# Altium schematic sheet Motor PCB.SchDoc
size Letter
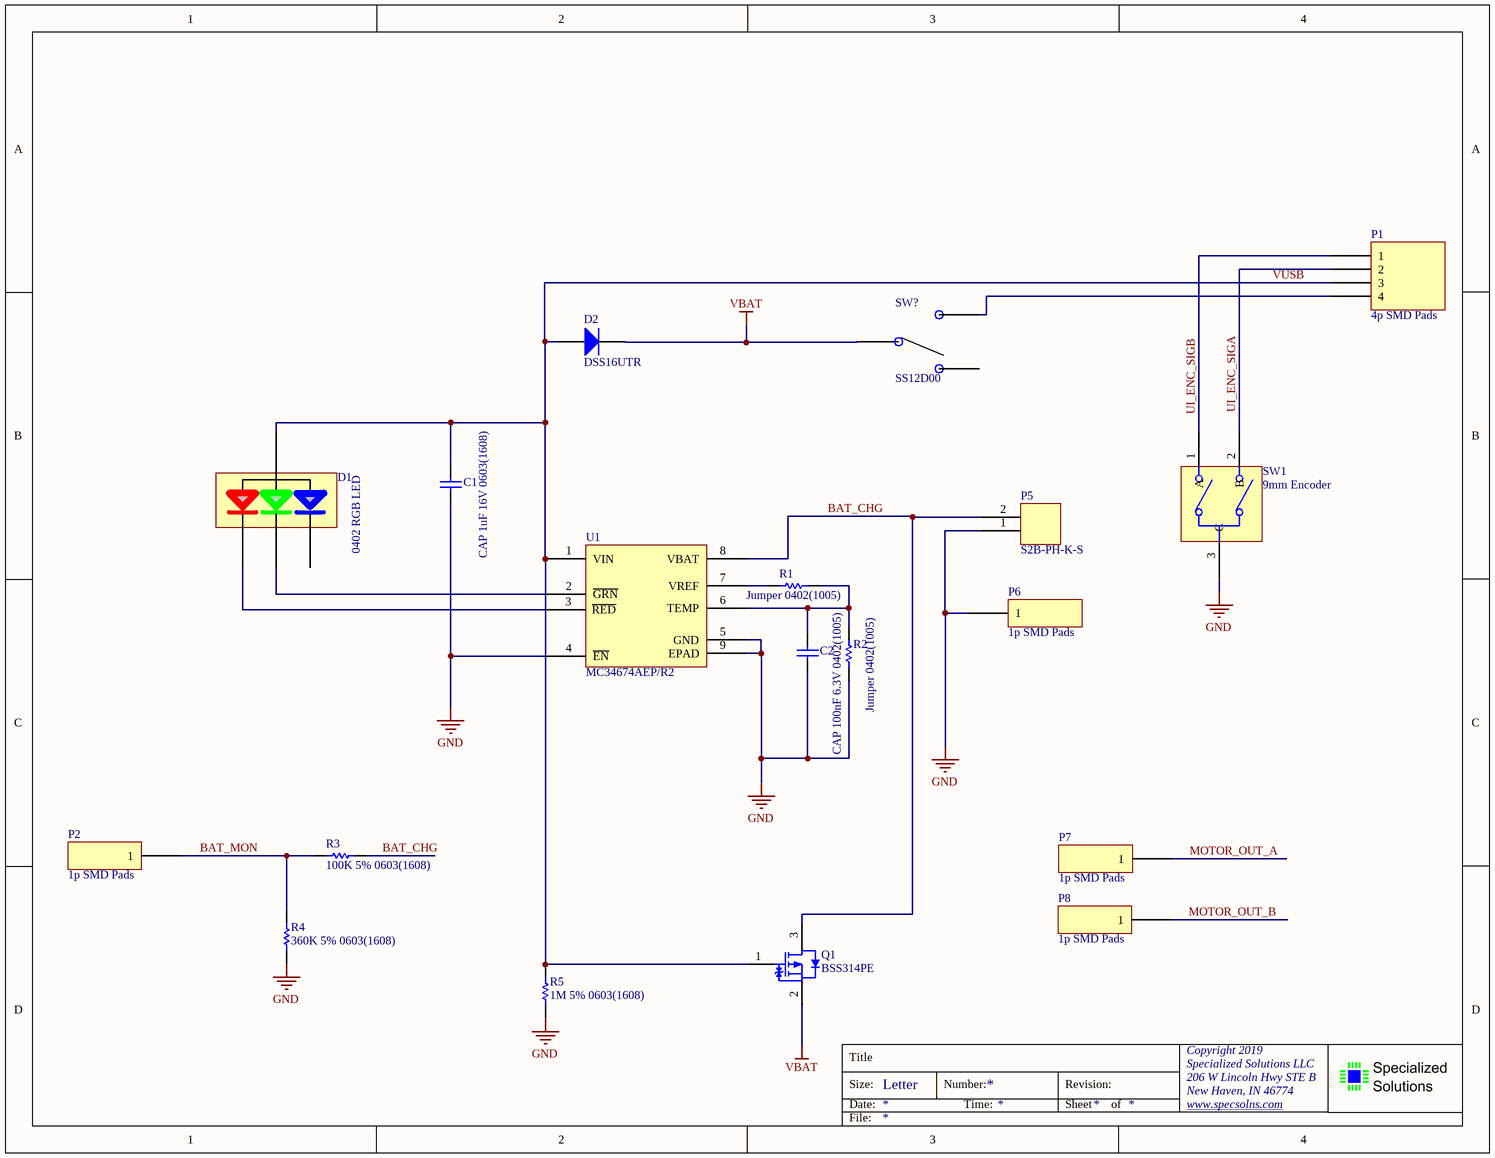
[diagram p0: Motor PCB.SchDoc]

## Parts
C1  CAP 1uF 16V 0603(1608)  [CAPC0603(1608)100_N]
C2  CAP 100nF 6.3V 0402(1005)  [CAPC0402(1005)60_N]
D1  0402 RGB LED  [0404 RGB LED]
D2  DSS16UTR  [MCC-SOD-123FL_V]
P1  4p SMD Pads  [4p SMD pad]
P2  1p SMD Pads  [1p SMD pad]
P5  S2B-PH-K-S  [S2B-PH-K-S]
P6  1p SMD Pads  [1p SMD pad]
P7  1p SMD Pads  [1p SMD pad]
P8  1p SMD Pads  [1p SMD pad]
Q1  BSS314PE  [INF-PG-SOT23_N]
R1  Jumper 0402(1005)  [RESC0402(1005)_N]
R2  Jumper 0402(1005)  [RESC0402(1005)_N]
R3  100K 5% 0603(1608)  [RESC0603(1608)_N]
R4  360K 5% 0603(1608)  [RESC0603(1608)_L]
R5  1M 5% 0603(1608)  [RESC0603(1608)_N]
SW1  9mm Encoder  [9mm encoder]
SW?  SS12D00  [DC2019 Switch]
U1  MC34674AEP/R2  [SON50P300X65_HS-9N]

## Nets
GND: C1.1 C2.1 P5.1 P6.1 R2.1 R4.1 R5.1 SW1.3(C) U1.4(~{EN}) U1.5(GND) U1.9(EPAD)
VBAT: D2.2(K) Q1.2(SOURCE) SW?.2
BAT_CHG: P5.2 Q1.3(DRAIN) R3.1 U1.8(VBAT)
BAT_MON: P2.1 R3.2 R4.2
MOTOR_OUT_A: P7.1
MOTOR_OUT_B: P8.1
UI_ENC_SIGA: P1.2 SW1.2(B)
UI_ENC_SIGB: P1.1 SW1.1(A)
VUSB: C1.2 D1.1 D2.1(A) P1.3 Q1.1(GATE) R5.2 U1.1(VIN)
NetC2_2: C2.2 R1.2 R2.2 U1.6(TEMP)
NetD1_2: D1.2 U1.3(~{RED})
NetD1_3: D1.3 U1.2(~{GRN})
NetP1_4: P1.4 SW?.3
NetR1_1: R1.1 U1.7(VREF)

Not connected (* = marked no-connect by the designer): D1 4; SW? 1

## Notes on the sheet
- Title
- Size:
- Date:
- Letter
- Number:
- Time:
- Revision:
- Sheet
- of
- Copyright 2019
- Specialized Solutions LLC
- 206 W Lincoln Hwy STE B
- New Haven, IN 46774
- www.specsolns.com <http://www.specsolns.com>
- File:

## Library data of the parts
C1 = CMP-1035-02736-1: CAP 1uF 16V ±5% 0603 (1608 Metric) Thickness 1mm SMD; Case-Metric: 1608; Case-EIA: 0603; Tolerance: Â±5%; Technology: SMT; Max Thickness: 1 mm; Rated Voltage: 16 V; Value: 1uF
C2 = CMP-1034-02061-1: CAP 100nF 6.3V ±10% 0402 (1005 Metric) Thickness 0.6mm SMD; Tolerance: Â±10%; Case-Metric: 1005; Case-EIA: 0402; Max Thickness: 0.6 mm; Value: 100nF; Technology: SMT; Rated Voltage: 6.3 V
D2 = CMP-2000-07084-1: SCHOTTKY 60V SOD-123FL; Manufacturer: Micro Commercial Components; Diode Configuration: Single; Diode Type: StandardRecovery; Forward Surge Current Ifsm Max: 30A; Forward Current If(AV): 1A; Forward Voltage VF Max: 1.1V; Repetitive Reverse Voltage Vrrm Max: 1kV; Manufacturer URL: http://www.mccsemi.com/; Datasheet URL: http://www.mccsemi.com/up_pdf/SM4001PL-SM4007PL(SOD-123FL).PDF; Package Description: 2-Pin Small Outline Diode, Flat Lead, Body 2.825 x 1.65 mm; Datasheet Version: Rev. H, 05/2015; Package Reference: SOD-123FL; Mounting Technology: SurfaceMount
P1 = 4p SMD
P2 P6-P8 = 1p SMD
P5 = S2B-PH-K-S: JST Right-Angle 2 ckt
Q1 = CMP-1099-00027-1: P-Channel OptiMOS P3 Small-Signal-Transistor, -30 V VDS, -1.5 A ID, -55 to 150 degC, PG-SOT23, Reel, Green; Manufacturer: Infineon; Rth: 250Â K/W; RDS (on) (max): 140Â mOhm; QG: -2.9Â nC; IDpuls (max): -6.1Â A; RDS (on) (max) (@4.5V): 230Â mOhm; Pto t (max): 0.5Â W; Green: TRUE; VDS (max): -30Â V; VGS(th) (max): -2Â V; VGS(th) (min): -1Â V; ID (max): -1.5Â A; ComponentLink2URL: http://www.infineon.com/dgdl/BSS314PE_rev2.3.pdf?folderId=db3a304314dca38901154a72e3951a65&fileId=db3a304330f68606013109b696aa0084; ComponentLink3Description: Package Specification; ComponentLink1URL: http://www.infineon.com/; ComponentLink1Description: Manufacturer URL; Mounting Technology: Surface Mount; PartNumber: BSS314PE; PackageReference: PG-SOT23; PackageVersion: Apr-08; Halogen-free: TRUE; ComponentLink3URL: http://www.infineon.com/dgdl/SOT23-Package_Overview.pdf?folderId=db3a30431936bc4b0119532290053c66&fileId=db3a30431936bc4b0119533468123c85; PackageDescription: 3-Pin Small Outline Transistor Package, 2.9 x 1.3 mm Body, 0.95 mm Pitch; ComponentLink2Description: Datasheet; DatasheetVersion: Rev. 2.3; Packing: Reel
R1 R2 = CMP-1011-00001-1: Jumper 0402 (1005 Metric); Tolerance: None; Case-Metric: 1005; Case-EIA: 0402; Value: 0.00 Ohm; Power: None; Technology: SMT
R3 = CMP-1012-00122-1: 100K 0.1W 5% 0603 (1608 Metric)  SMD; Case-EIA: 0603; Value: 100000.00 Ohm; Case-Metric: 1608; Tolerance: 5 %; Power: 0.1 W; Technology: SMT
R4 = CMP-1012-00135-1: 360K 0.1W 5% 0603 (1608 Metric)  SMD; Case-EIA: 0603; Case-Metric: 1608; Value: 360000.00 Ohm; Tolerance: 5 %; Technology: SMT; Power: 0.1 W
R5 = CMP-1012-00146-1: 1M 0.1W 5% 0603 (1608 Metric)  SMD; Case-EIA: 0603; Value: 1000000.00 Ohm; Case-Metric: 1608; Technology: SMT; Power: 0.1 W; Tolerance: 5 %
SW? = DC2019 Switch
U1 = MC34674AEP/R2: High Input Voltage 1.05A Charger for Single-cell Li-Ion Batteries